# EAGLE design tappytap (EAGLE 7.3.0)
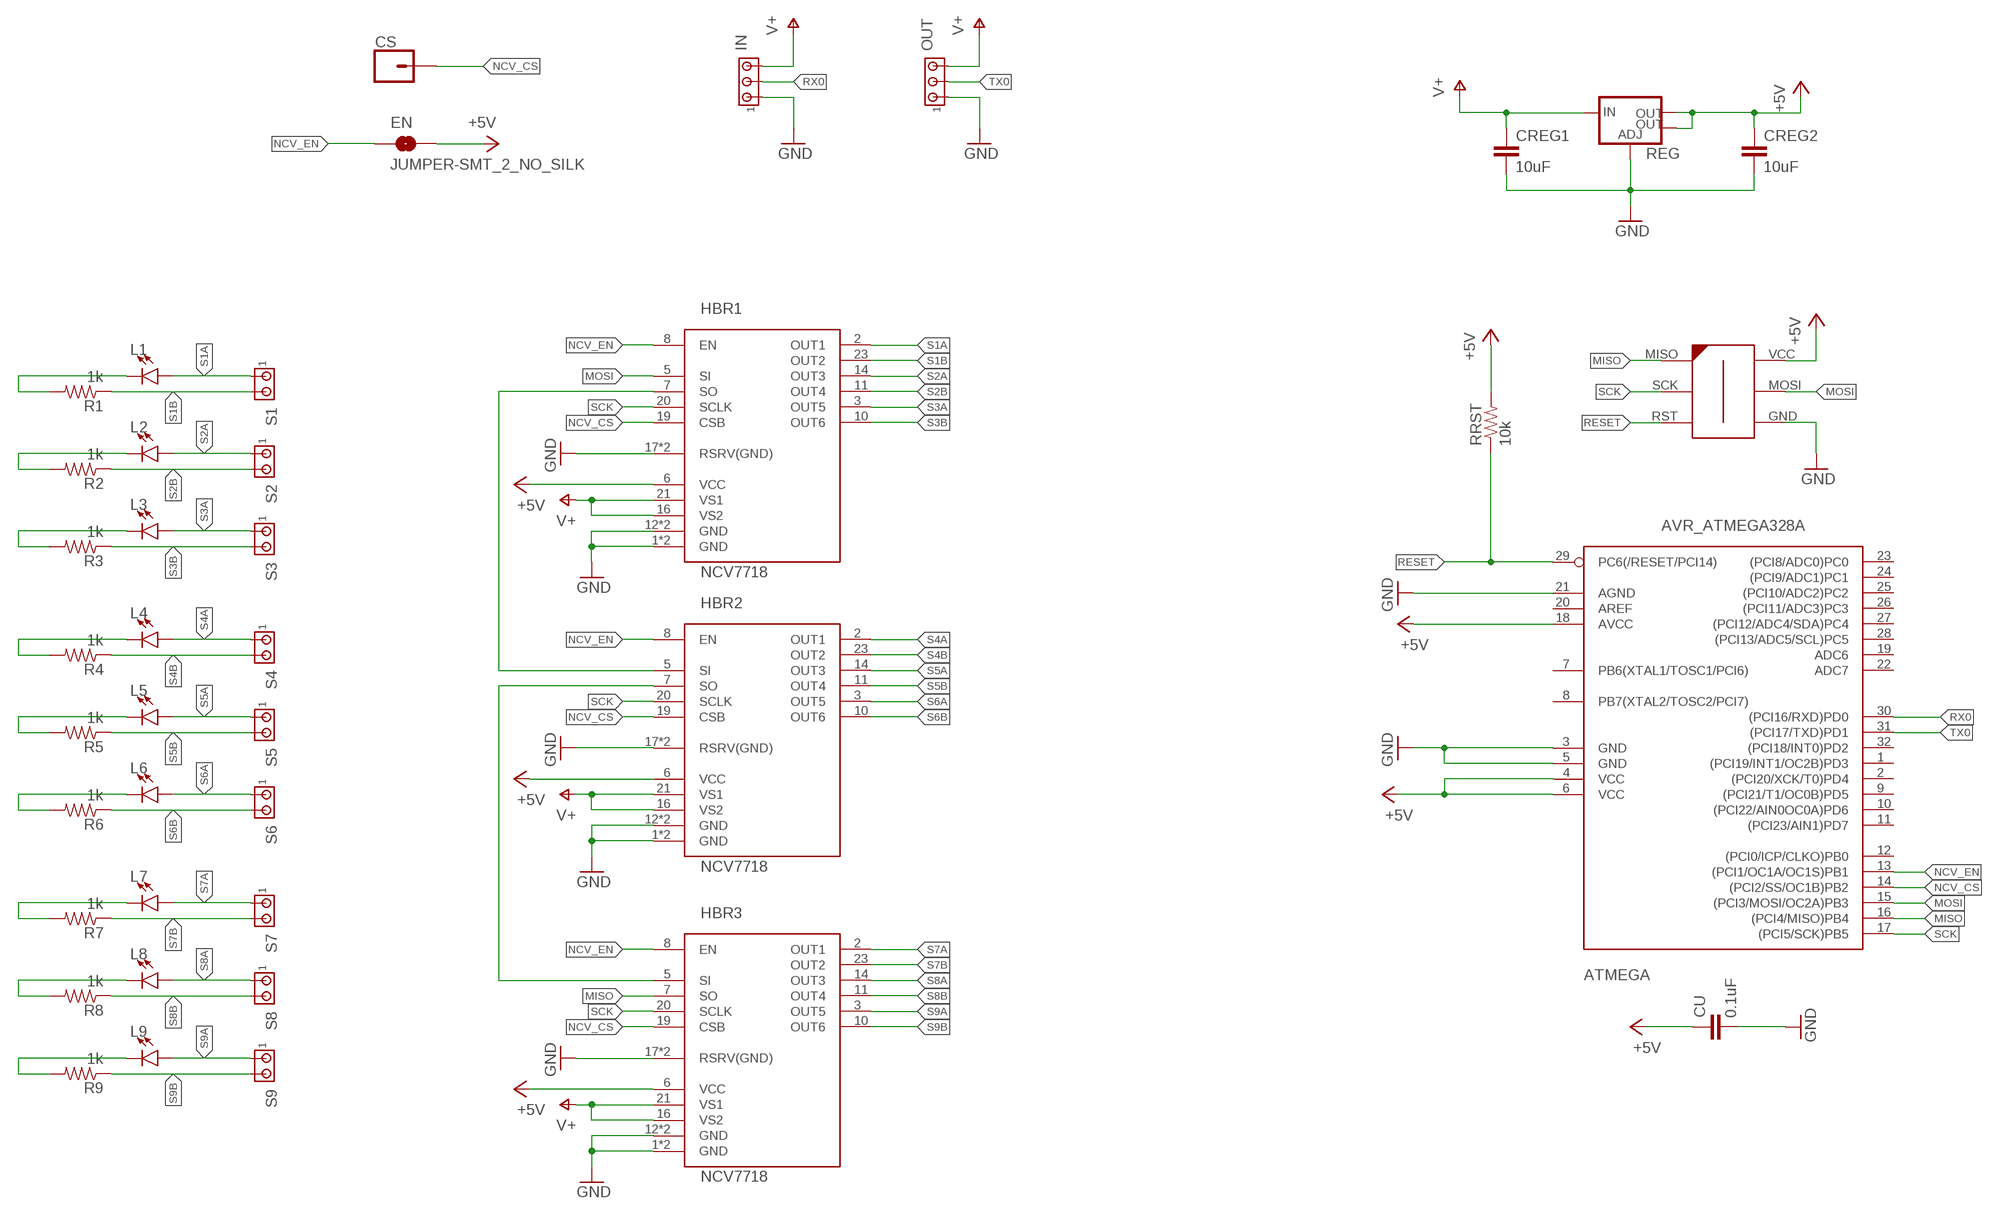
[diagram p0: schematic, sheet 1]

## Parts
ATMEGA  AVR_ATMEGA328A  [AVR_TQFP32-08]
CREG1  10uF  C-EUC0603  [C0603]
CREG2  10uF  C-EUC0603  [C0603]
CS  CONN_01  [1X01]
CU  0.1uF  C-EUC0603  [C0603]
EN  JUMPER-SMT_2_NO_SILK  [SMT-JUMPER_2_NO_SILK]
HBR1  NCV7718  [24-SSOP]
HBR2  NCV7718  [24-SSOP]
HBR3  NCV7718  [24-SSOP]
IN  MTA03-100  [10X03MTA]
ISP  AVR-ISP-6-EDGE  [6PAD_ISP]
L1  LED0603  [LED-0603]
L2  LED0603  [LED-0603]
L3  LED0603  [LED-0603]
L4  LED0603  [LED-0603]
L5  LED0603  [LED-0603]
L6  LED0603  [LED-0603]
L7  LED0603  [LED-0603]
L8  LED0603  [LED-0603]
L9  LED0603  [LED-0603]
OUT  MTA03-100  [10X03MTA]
R1  1k  R-US_R0603  [R0603]
R2  1k  R-US_R0603  [R0603]
R3  1k  R-US_R0603  [R0603]
R4  1k  R-US_R0603  [R0603]
R5  1k  R-US_R0603  [R0603]
R6  1k  R-US_R0603  [R0603]
R7  1k  R-US_R0603  [R0603]
R8  1k  R-US_R0603  [R0603]
R9  1k  R-US_R0603  [R0603]
REG  V_REG_LM1117SOT223  [SOT223]
RRST  10k  R-US_R0603  [R0603]
S1  MTA02-100  [10X02MTA]
S2  MTA02-100  [10X02MTA]
S3  MTA02-100  [10X02MTA]
S4  MTA02-100  [10X02MTA]
S5  MTA02-100  [10X02MTA]
S6  MTA02-100  [10X02MTA]
S7  MTA02-100  [10X02MTA]
S8  MTA02-100  [10X02MTA]
S9  MTA02-100  [10X02MTA]

## Nets
+5V [usbvcc]: ATMEGA.4(VCC) ATMEGA.6(VCC) ATMEGA.18(AVCC) CREG2.1 CU.1 EN.2 HBR1.6(VCC) HBR2.6(VCC) HBR3.6(VCC) ISP.VCC REG.2(OUT) REG.4(OUT) RRST.2
GND [gnd]: ATMEGA.3(GND) ATMEGA.5(GND) ATMEGA.21(AGND) CREG1.2 CREG2.2 CU.2 HBR1.1(GND) HBR1.12(GND) HBR1.13(GND) HBR1.17(RSRV(GND)) HBR1.18(RSRV(GND)) HBR1.24(GND) HBR2.1(GND) HBR2.12(GND) HBR2.13(GND) HBR2.17(RSRV(GND)) HBR2.18(RSRV(GND)) HBR2.24(GND) HBR3.1(GND) HBR3.12(GND) HBR3.13(GND) HBR3.17(RSRV(GND)) HBR3.18(RSRV(GND)) HBR3.24(GND) IN.1 ISP.GND OUT.1 REG.1(ADJ)
MISO: ATMEGA.16((PCI4/MISO)PB4) HBR3.7(SO) ISP.MISO
MOSI: ATMEGA.15((PCI3/MOSI/OC2A)PB3) HBR1.5(SI) ISP.MOSI
N$5: L1.C R1.2
N$9: L2.C R2.2
N$12: L3.C R3.2
N$15: L4.C R4.2
N$18: L5.C R5.2
N$21: L6.C R6.2
N$24: HBR1.7(SO) HBR2.5(SI)
N$25: L7.C R7.2
N$26: HBR2.7(SO) HBR3.5(SI)
N$29: L8.C R8.2
N$32: L9.C R9.2
NCV_CS: ATMEGA.14((PCI2/SS/OC1B)PB2) CS.1 HBR1.19(CSB) HBR2.19(CSB) HBR3.19(CSB)
NCV_EN: ATMEGA.13((PCI1/OC1A/OC1S)PB1) EN.1 HBR1.8(EN) HBR2.8(EN) HBR3.8(EN)
RESET: ATMEGA.29(PC6(/RESET/PCI14)) ISP.RST RRST.1
RX0: ATMEGA.30((PCI16/RXD)PD0) IN.2
S1A: HBR1.2(OUT1) L1.A S1.1
S1B: HBR1.23(OUT2) R1.1 S1.2
S2A: HBR1.14(OUT3) L2.A S2.1
S2B: HBR1.11(OUT4) R2.1 S2.2
S3A: HBR1.3(OUT5) L3.A S3.1
S3B: HBR1.10(OUT6) R3.1 S3.2
S4A: HBR2.2(OUT1) L4.A S4.1
S4B: HBR2.23(OUT2) R4.1 S4.2
S5A: HBR2.14(OUT3) L5.A S5.1
S5B: HBR2.11(OUT4) R5.1 S5.2
S6A: HBR2.3(OUT5) L6.A S6.1
S6B: HBR2.10(OUT6) R6.1 S6.2
S7A: HBR3.2(OUT1) L7.A S7.1
S7B: HBR3.23(OUT2) R7.1 S7.2
S8A: HBR3.14(OUT3) L8.A S8.1
S8B: HBR3.11(OUT4) R8.1 S8.2
S9A: HBR3.3(OUT5) L9.A S9.1
S9B: HBR3.10(OUT6) R9.1 S9.2
SCK: ATMEGA.17((PCI5/SCK)PB5) HBR1.20(SCLK) HBR2.20(SCLK) HBR3.20(SCLK) ISP.SCK
TX0: ATMEGA.31((PCI17/TXD)PD1) OUT.2
V+: CREG1.1 HBR1.16(VS2) HBR1.21(VS1) HBR2.16(VS2) HBR2.21(VS1) HBR3.16(VS2) HBR3.21(VS1) IN.3 OUT.3 REG.3(IN)
Unconnected: ATMEGA.1((PCI19/INT1/OC2B)PD3) ATMEGA.2((PCI20/XCK/T0)PD4) ATMEGA.7(PB6(XTAL1/TOSC1/PCI6)) ATMEGA.8(PB7(XTAL2/TOSC2/PCI7)) ATMEGA.9((PCI21/T1/OC0B)PD5) ATMEGA.10((PCI22/AIN0OC0A)PD6) ATMEGA.11((PCI23/AIN1)PD7) ATMEGA.12((PCI0/ICP/CLKO)PB0) ATMEGA.19(ADC6) ATMEGA.20(AREF) ATMEGA.22(ADC7) ATMEGA.23((PCI8/ADC0)PC0) ATMEGA.24((PCI9/ADC1)PC1) ATMEGA.25((PCI10/ADC2)PC2) ATMEGA.26((PCI11/ADC3)PC3) ATMEGA.27((PCI12/ADC4/SDA)PC4) ATMEGA.28((PCI13/ADC5/SCL)PC5) ATMEGA.32((PCI18/INT0)PD2)

## Library data of the parts
ATMEGA = avr:AVR_ATMEGA328: MICROCONTROLLER 32 kBytes FLASH 1 kBytes SRAM 512 Bytes EEPROM USART 8-channel 10 bit ADC
CREG1 CREG2 CU = rcl:C-EU: CAPACITOR, European symbol
CS = SparkFun-Connectors:CONN_01: Single connection point. Often used as Generic Header-pin footprint for 0.1 inch spaced/style header connections On any of the 0.1 inch spaced packages, you can populate with these: Break Away Headers - Straight <https://www.sparkfun.com/products/116> (PRT-00116) Break Away Male Headers - Right Angle <https://www.sparkfun.com/products/553> (PRT-00553) Female Headers <https://www.sparkfun.com/products/115> (PRT-00115) Break Away Headers - Machine Pin <https://www.sparkfun.com/products/117> (PRT-00117) Break Away Female Headers - Swiss Machine Pin <https://www.sparkfun.com/products/743> (PRT-00743) This device is also useful as a general connection point to wire up your design to another part of your project. Our various solder wires solder well into these plated through hole pads. Hook-Up Wire - Assortment (Stranded, 22 AWG) <https://www.sparkfun.com/products/11375> (PRT-11375) Hook-Up Wire - Assortment (Solid Core, 22 AWG) <https://www.sparkfun.com/products/11367> (PRT-11367) View the entire wire category on our website here <https://www.sparkfun.com/categories/141> Special notes: SMTSO-256-ET is a "flush mount" nut for a 4-40 screw. We mostly use this on specialty testbeds; it is a nice way to connect hardware to your PCB at an adjustable hieght. Also note, the SNAP packages are for using a snappable style connector. We sell a baggie of snaps and they are also used on two LilyPad designs: Snap Assortment - 30 pack (male and female) <https://www.sparkfun.com/products/11347> (DEV-11347) LilyPad Arduino SimpleSnap <https://www.sparkfun.com/products/10941> (DEV-10941) LilyPad SimpleSnap Protoboard <https://www.sparkfun.com/products/10940> (DEV-10940)
EN = SparkFun-Jumpers:JUMPER-SMT_2_NO: Normally open jumper This jumper has two pads in close proximity to each other. Apply solder to close the connection. Round pads are easier to solder for beginners, but are a lot larger. SparkFun Product that uses the round pads: SparkFun EL Sequencer <https://www.sparkfun.com/products/12781>
HBR1-HBR3 = Sparky:NCV7718: Hex Half−Bridge Driver. The device can be operated in forward, reverse, brake, and high impedance states. The drivers are controlled via a 16 bit SPI interface and are daisy chain compatible.
IN OUT = con-amp:MTA03-100: AMP connector
ISP = avr-6:AVR-ISP-6-EDGE: 6 pin edge connector for ISP with ATMEL MCUs. Developed by Craig Moates (craig at moates dot net). Library by David Blundell (blundar at gmail dot com). Often, even a 6 pin header is really inconvenient for board layout and/or production. This SMD-only header is our de-facto standard for using an edge connector for programming with the help of a 6pin/10pin to edge card adapter.
L1-L9 = SparkFun-LED:LED: LED (Generic) Standard schematic elements and footprints for 5mm, 3mm, 1206, and 0603 sized LEDs. Generic LEDs with no color specified.
R1-R9 RRST = rcl:R-US_: RESISTOR, American symbol
REG = SparkFun-IC-Power:V_REG_LM1117: Voltage Regulator LM1117 Standard adjustable voltage regulator but in SMD form. Spark Fun Electronics SKU : COM-00595; PROD_ID: VREG-08170
S1-S9 = con-amp:MTA02-100: AMP connector

## Board
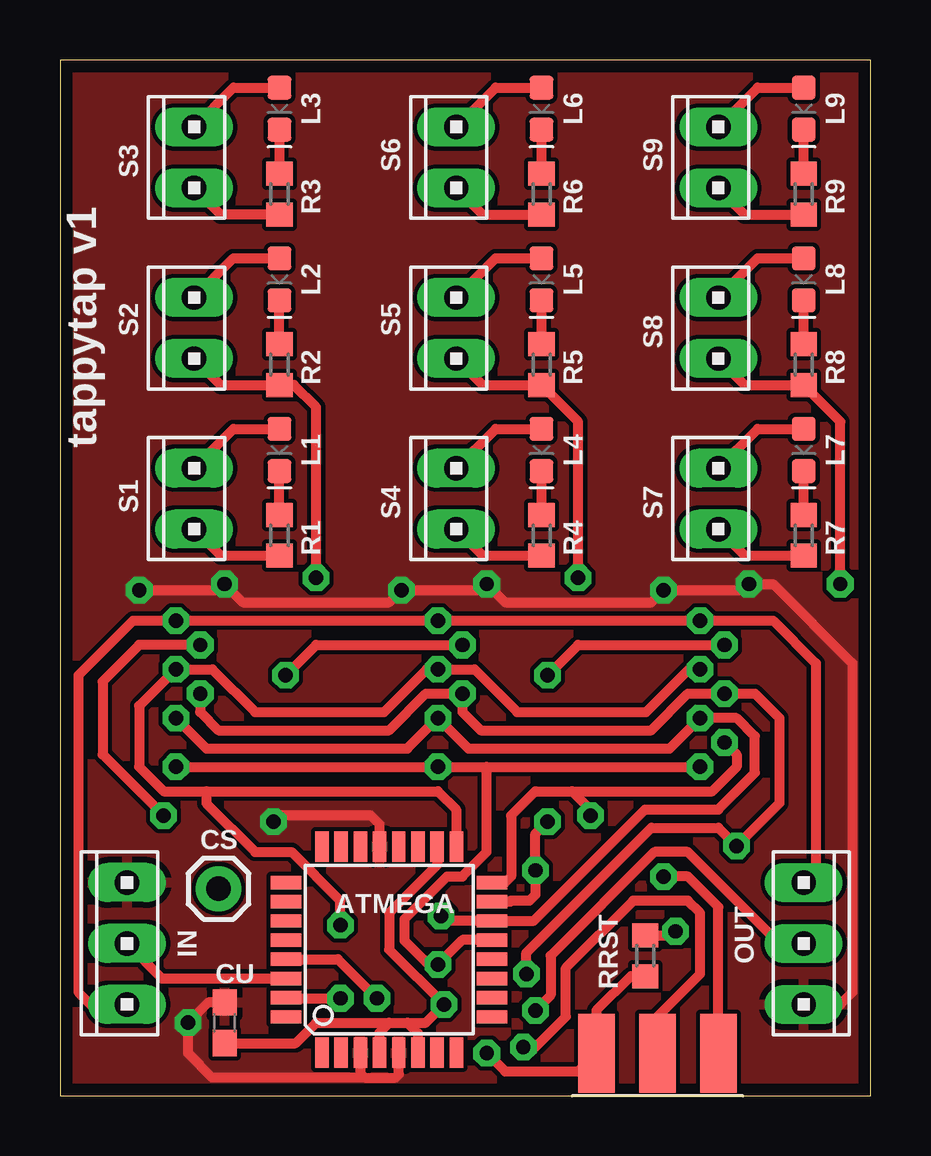
[diagram p1: board, top side]
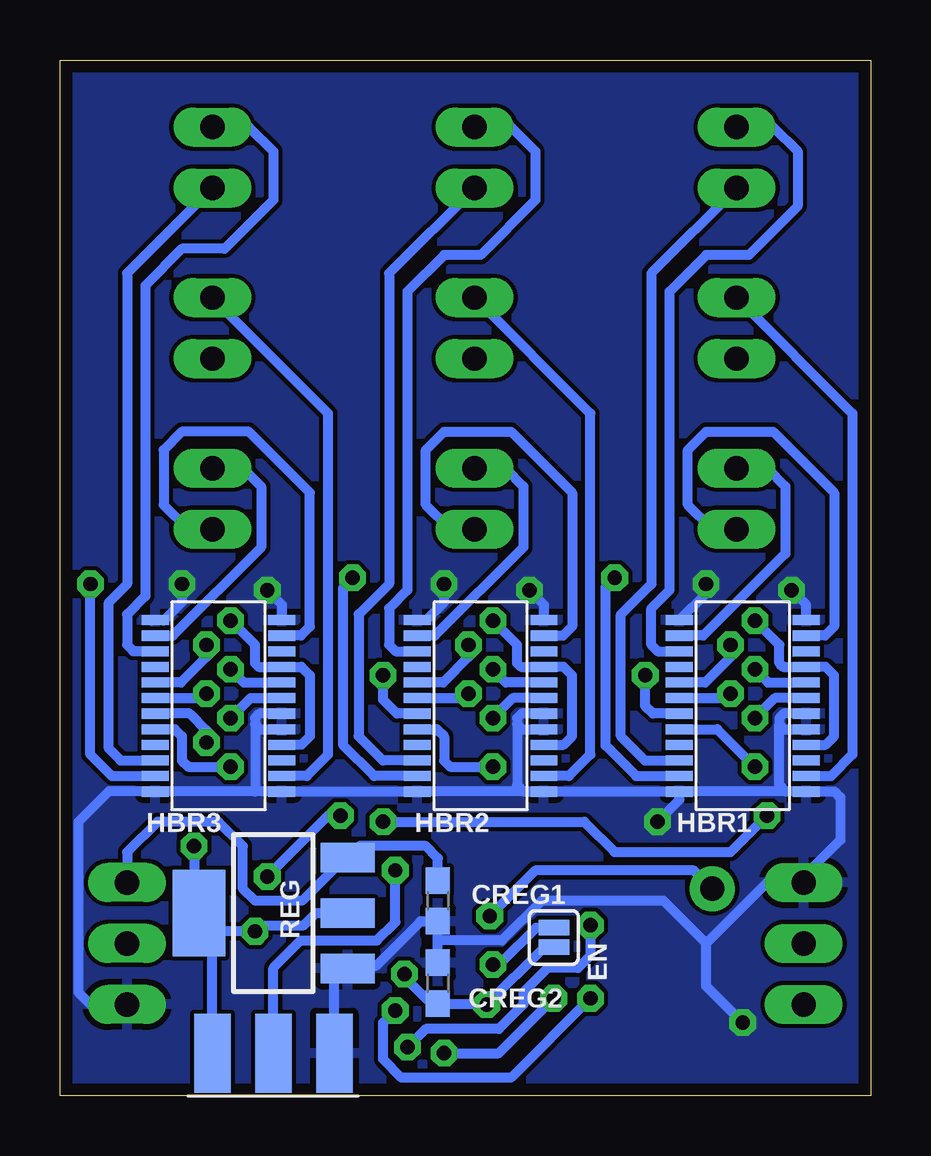
[diagram p2: board, bottom side, seen from below]

Size 33.78 x 43.18 mm. Coordinates in mm from the lower left corner, seen from the top.
Outline: 0,0 33.78,0 33.78,43.18 0,43.18 0,0
Copper layers (1*16): Top 0.035mm / dielectric 1.5mm / Bottom 0.035mm
Design rules "APC *": minimum track width 7mil, minimum drill 15mil, track to track 7mil, track to pad 7mil, pad to pad 7mil, via to via 7mil, smd to smd 0mil, copper to edge 20mil, drill to drill 20mil, minimum pad ring 12mil, minimum via ring 10mil, stop-mask expansion 4mil, vias tented up to drill 25mil, thermal gap 10mil

### Footprints (pad centres in the part's own frame; a part is rotated, then mirrored left to right if it is on the bottom)
AVR_TQFP32-08 = smd 1.27 x 0.559: 1 -4.293,2.8; 2 -4.293,2; 3 -4.293,1.2; 4 -4.293,0.4; 5 -4.293,-0.4; 6 -4.293,-1.2; 7 -4.293,-2; 8 -4.293,-2.8; 17 4.293,-2.8; 18 4.293,-2; 19 4.293,-1.2; 20 4.293,-0.4; 21 4.293,0.4; 22 4.293,1.2; 23 4.293,2; 24 4.293,2.8 | smd 0.559 x 1.27: 9 -2.8,-4.293; 10 -2,-4.293; 11 -1.2,-4.293; 12 -0.4,-4.293; 13 0.4,-4.293; 14 1.2,-4.293; 15 2,-4.293; 16 2.8,-4.293; 25 2.8,4.293; 26 2,4.293; 27 1.2,4.293; 28 0.4,4.293; 29 -0.4,4.293; 30 -1.2,4.293; 31 -2,4.293; 32 -2.8,4.293
C0603 = smd 1.1 x 1: 1 -0.85,0; 2 0.85,0
1X01 = drill 1.016 pad 1.88: 1 0,0
SMT-JUMPER_2_NO_SILK = smd 0.635 x 1.27: 1 -0.406,0; 2 0.406,0
24-SSOP = smd 1.12 x 0.42: 1 -2.64,3.575; 2 -2.64,2.925; 3 -2.64,2.275; 4 -2.64,1.625; 5 -2.64,0.975; 6 -2.64,0.325; 7 -2.64,-0.325; 8 -2.64,-0.975; 9 -2.64,-1.625; 10 -2.64,-2.275; 11 -2.64,-2.925; 12 -2.64,-3.575; 13 2.64,-3.575; 14 2.64,-2.925; 15 2.64,-2.275; 16 2.64,-1.625; 17 2.64,-0.975; 18 2.64,-0.325; 19 2.64,0.325; 20 2.64,0.975; 21 2.64,1.625; 22 2.64,2.275; 23 2.64,2.925; 24 2.64,3.575
10X03MTA = drill 1.016 long: 1 2.54,0; 2 0,0; 3 -2.54,0
6PAD_ISP = smd 1.524 x 3.302 bottom: GND 2.54,0; MOSI 0,0; VCC -2.54,0 | smd 1.524 x 3.302: MISO -2.54,0; RST 2.54,0; SCK 0,0
LED-0603 = smd 1 x 1: A -0.877,0; C 0.877,0
R0603 = smd 1 x 1.1: 1 -0.85,0; 2 0.85,0
SOT223 = smd 1.219 x 2.235: 1 -2.311,-3.099; 2 0,-3.099; 3 2.311,-3.099 | smd 3.6 x 2.2: 4 0,3.099
10X02MTA = drill 1.016 long: 1 1.27,0; 2 -1.27,0

### Placement (x,y rotation side)
ATMEGA  13.72,6.1 90 top
CREG1  18.03,8.13 270 bottom
CREG2  18.03,4.7 90 bottom
CS  6.6,8.64 0 top
CU  6.86,3.05 90 top
EN  13.21,6.6 270 bottom
HBR1  5.33,16.26 0 bottom
HBR2  16.26,16.26 0 bottom
HBR3  27.18,16.26 0 bottom
IN  2.79,6.35 90 top
ISP  24.89,1.78 180 top
L1  9.14,26.92 270 top
L2  9.14,34.04 270 top
L3  9.14,41.15 270 top
L4  20.07,26.92 270 top
L5  20.07,34.04 270 top
L6  20.07,41.15 270 top
L7  30.99,26.92 270 top
L8  30.99,34.04 270 top
L9  30.99,41.15 270 top
OUT  30.99,6.35 270 top
R1  9.14,23.37 90 top
R2  9.14,30.48 90 top
R3  9.14,37.59 90 top
R4  20.07,23.37 90 top
R5  20.07,30.48 90 top
R6  20.07,37.59 90 top
R7  30.99,23.37 90 top
R8  30.99,30.48 90 top
R9  30.99,37.59 90 top
REG  24.89,7.62 90 bottom
RRST  24.38,5.84 90 top
S1  5.59,24.89 90 top
S2  5.59,32 90 top
S3  5.59,39.12 90 top
S4  16.51,24.89 90 top
S5  16.51,32 90 top
S6  16.51,39.12 90 top
S7  27.43,24.89 90 top
S8  27.43,32 90 top
S9  27.43,39.12 90 top

### Tracks (layer width: path | path; a pad name or v marks a point on that pad's centre or on a via)
+5V  (via drill 0.6)
  Top 0.406: v5.84,16.76 5.84,16 6.6,15.24 13.72,15.24 15.24,16.76 v16.76,16.76 16.76,16 17.53,15.24 24.64,15.24 26.16,16.76 v27.69,16.76 28.96,16.76 29.97,15.75 29.97,12.19 v28.19,10.41 27.43,11.18 24.64,11.18 19.43,5.97 v19.43,5.08 | ATMEGA.4 13.32,2.65 13.72,3.05 | 13.72,3.05 14.48,3.05 | 14.48,3.05 14.92,2.61 ATMEGA.6 | 15.75,10.42 ATMEGA.18 | 15.75,10.36 ATMEGA.18 | CU.1 9.82,2.2 10.67,3.05 13.72,3.05 | RRST.2 25.49,6.69 v25.65,6.86 | 14.48,3.05 15.24,3.05 v16,3.81 13.72,6.1 13.72,7.62 15.72,9.62 ATMEGA.18
  Bottom 0.406: ISP.VCC 27.43,7.37 | 27.43,7.37 27.43,7.62 REG.4 28.19,7.82 v28.19,10.41 | 27.43,7.37 26.92,6.86 v25.65,6.86 25.4,7.11 23.62,7.11 23.11,7.62 REG.2 | v19.43,5.08 19.43,4.95 18.33,3.85 CREG2.1 18,3.81 v16,3.81 13.61,6.2 EN.2 | HBR1.6 6.03,16.58 v5.84,16.76 | HBR2.6 16.95,16.58 v16.76,16.76 | HBR3.6 27.87,16.58 v27.69,16.76
GND  (via drill 0.6)
  Top 0.406: v3.3,21.08 6.6,21.08 v6.86,21.34 7.62,20.57 13.72,20.57 v14.22,21.08 17.53,21.08 v17.78,21.34 18.54,20.57 24.64,20.57 v25.15,21.08 28.45,21.08 v28.7,21.34 29.72,21.34 33.02,18.03 33.02,4.32 32.51,3.81 OUT.1 | ATMEGA.21 13.32,11.32 12.95,11.68 9.14,11.68 v8.89,11.43 | ATMEGA.3 12.52,0.95 12.7,0.76 | 12.7,0.76 13.97,0.76 14.12,0.91 ATMEGA.5 | CU.2 6.18,3.9 v5.33,3.05 5.33,1.78 6.35,0.76 12.7,0.76
  Bottom 0.406: v14.22,21.08 13.62,20.47 HBR2.24 | v25.15,21.08 24.54,20.47 HBR3.24 | v28.7,21.34 28.7,20.57 29.46,19.81 29.97,19.81 | OUT.1 32.51,3.81 33.02,4.32 33.02,11.43 31.75,12.7 29.97,12.7 29.95,12.68 25.65,12.68 | CREG2.2 18.03,6.48 | 18.03,6.48 CREG1.2 | v5.33,3.05 6.86,4.57 6.86,6.35 | ISP.GND 22.35,4.75 REG.1 21.68,5.42 20.61,5.42 18.76,7.28 CREG1.2 | 18.38,7.28 CREG1.2 | HBR1.18 3.63,15.93 3.81,15.75 3.81,15.49 | 3.81,15.49 3.6,15.28 HBR1.17 | 3.56,12.7 3.54,12.68 HBR1.13 1.5,12.68 1.27,12.45 1.27,10.67 2.79,9.14 IN.1 4.32,8.89 6.86,6.35 | 3.56,12.7 3.81,12.95 3.81,15.49 | HBR1.1 6.86,20.95 v6.86,21.34 | HBR1.24 2.69,20.47 v3.3,21.08 | HBR2.1 18.52,19.83 17.78,20.57 v17.78,21.34 | HBR2.18 14.55,15.93 14.73,15.75 14.73,15.49 | 14.73,15.49 14.52,15.28 HBR2.17 | 14.73,15.49 14.73,12.95 14.46,12.68 | 14.46,12.68 HBR2.13 HBR1.12 7.97,12.35 v8.89,11.43 | HBR2.12 HBR3.13 25.65,12.68 | 3.56,12.7 8.13,12.7 | 14.46,12.68 19.29,12.68 19.3,12.7 | HBR3.18 25.47,15.93 25.65,15.75 25.65,15.49 | 25.65,15.49 25.44,15.28 HBR3.17 | 25.65,15.49 25.65,12.68 | 6.86,6.35 8.64,8.13 13.72,8.13 15.37,6.48 18.03,6.48
  pour Bottom: 0,0 0,43.18 33.78,43.18 33.78,0
  pour Top: 0,0 0,43.18 33.78,43.18 33.78,0
MISO  (via drill 0.6)
  Top 0.406: v27.69,14.73 28.19,14.22 28.19,13.72 27.18,12.7 21.34,12.7 | ATMEGA.16 18.54,8.89 18.8,9.14 18.8,11.68 19.81,12.7 21.34,12.7 | ISP.MISO 27.43,7.87 26.16,9.14 v25.15,9.14 | v22.1,11.68 22.1,11.94 21.34,12.7
  Bottom 0.406: v27.69,14.73 27.69,15.24 28.38,15.93 HBR3.7 | v25.15,9.14 22.61,11.68 v22.1,11.68
MOSI  (via drill 0.6)
  Top 0.406: v5.84,18.8 3.3,18.8 1.78,17.27 1.78,14.22 v4.32,11.68 | ATMEGA.15 18.76,8.1 18.8,8.13 19.56,8.13 19.81,8.38 v19.81,9.4 19.81,10.92 v20.32,11.43
  Bottom 0.406: v5.84,18.8 5.84,18.29 6.86,17.27 6.9,17.23 HBR1.5 | v4.32,11.68 5.84,10.16 10.67,10.16 11.94,11.43 v20.32,11.43 | ISP.MOSI 24.89,5.33 23.75,6.48 20.57,6.48 19.81,7.24 v19.81,9.4
N$5
  Top 0.406: R1.2 L1.C
N$9
  Top 0.406: R2.2 L2.C
N$12
  Top 0.406: L3.C R3.2
N$15
  Top 0.406: R4.2 L4.C
N$18
  Top 0.406: R5.2 L5.C
N$21
  Top 0.406: R6.2 L6.C
N$24  (via drill 0.6)
  Top 0.406: v9.4,17.53 10.67,18.8 v16.76,18.8
  Bottom 0.406: HBR1.7 9.07,15.93 9.4,16.26 v9.4,17.53 | v16.76,18.8 16.76,18.29 17.82,17.23 HBR2.5
N$25
  Top 0.406: R7.2 L7.C
N$26  (via drill 0.6)
  Top 0.406: v20.32,17.53 21.59,18.8 v27.69,18.8
  Bottom 0.406: HBR2.7 19.74,15.93 20.32,16.51 v20.32,17.53 | v27.69,18.8 27.69,18.29 28.74,17.23 HBR3.5
N$29
  Top 0.406: R8.2 L8.C
N$32
  Top 0.406: R9.2 L9.C
NCV_CS  (via drill 0.6)
  Top 0.406: v4.83,15.75 6.1,14.48 14.48,14.48 v15.75,15.75 17.02,14.48 25.4,14.48 v26.67,15.75 28.19,15.75 28.96,14.99 28.96,13.46 27.43,11.94 24.38,11.94 19.74,7.3 ATMEGA.14 16.07,7.3 v15.88,7.49
  Bottom 0.406: v4.83,15.75 3.99,16.58 HBR1.19 | v15.75,15.75 14.91,16.58 HBR2.19 | v26.67,15.75 25.84,16.58 HBR3.19 | CS.1 7.37,9.4 13.97,9.4 v15.88,7.49
NCV_EN  (via drill 0.6)
  Top 0.406: v4.83,13.72 v15.75,13.72 17.78,13.72 | 17.78,13.72 v26.67,13.72 | 17.78,13.72 17.78,10.16 16.76,9.14 16.13,9.14 14.35,7.37 14.35,6.48 15.35,5.48 v15.75,5.48 16.76,6.5 ATMEGA.13
  Bottom 0.406: v15.75,13.72 17.53,13.72 17.78,13.97 17.78,14.99 18.07,15.28 HBR2.8 | v26.67,13.72 28.45,13.72 28.7,13.97 28.7,14.99 29,15.28 HBR3.8 | v4.83,13.72 6.39,15.28 HBR1.8 | EN.1 13.95,7.01 15.47,5.48 v15.75,5.48
RESET  (via drill 0.6)
  Top 0.406: 22.35,2.54 ISP.RST | RRST.1 23.79,4.99 22.35,3.56 ISP.RST | v17.78,1.78 18.54,1.02 21.59,1.02 ISP.RST | ATMEGA.29 11.58,5.7 v13.21,4.06
  Bottom 0.406: v17.78,1.78 15.49,1.78 v13.21,4.06
RX0
  Top 0.406: IN.2 4.25,4.9 ATMEGA.30
S1A
  Top 0.406: S1.1 7.23,27.8 L1.A
  Bottom 0.406: S1.1 4.32,26.16 3.56,25.4 3.56,22.61 6.98,19.18 HBR1.2
S1B
  Top 0.406: S1.2 6.69,22.52 R1.1
  Bottom 0.406: S1.2 6.6,23.62 7.62,24.64 7.62,26.92 6.86,27.69 4.06,27.69 1.52,25.15 1.52,19.56 1.9,19.18 HBR1.23
S2A
  Top 0.406: S2.1 7.23,34.91 L2.A
  Bottom 0.406: S2.1 0.76,28.45 0.76,14.22 1.66,13.33 HBR1.14
S2B  (via drill 0.6)
  Top 0.406: S2.2 6.69,29.63 R2.1 9.74,29.63 10.67,28.7 v10.67,21.59
  Bottom 0.406: v10.67,21.59 11.05,21.21 11.05,14.61 9.78,13.33 HBR1.11
S3A
  Top 0.406: S3.1 7.23,42.02 L3.A
  Bottom 0.406: S3.1 4.06,40.39 3.05,39.37 3.05,37.08 5.08,35.05 6.86,35.05 8.38,33.53 8.38,21.08 9.14,20.32 9.14,18.8 8.88,18.53 HBR1.3
S3B
  Top 0.406: R3.1 6.69,36.74 S3.2
  Bottom 0.406: S3.2 9.14,34.29 9.14,21.34 10.41,20.07 10.41,14.99 9.41,13.98 HBR1.10
S4A
  Top 0.406: S4.1 18.15,27.8 L4.A
  Bottom 0.406: S4.1 15.24,26.16 14.48,25.4 14.48,22.86 18.16,19.18 HBR2.2
S4B
  Top 0.406: S4.2 17.61,22.52 R4.1
  Bottom 0.406: S4.2 17.53,23.62 18.54,24.64 18.54,26.92 17.78,27.69 14.99,27.69 12.45,25.15 12.45,19.56 12.82,19.18 HBR2.23
S5A
  Top 0.406: S5.1 18.15,34.91 L5.A
  Bottom 0.406: S5.1 11.68,28.45 11.68,14.22 12.58,13.33 HBR2.14
S5B  (via drill 0.6)
  Top 0.406: S5.2 17.61,29.63 R5.1 21.59,28.11 v21.59,21.59
  Bottom 0.406: v21.59,21.59 21.97,21.21 21.97,14.61 20.7,13.33 HBR2.11
S6A
  Top 0.406: S6.1 18.15,42.02 L6.A
  Bottom 0.406: S6.1 14.99,40.39 13.97,39.37 13.97,37.34 16.26,35.05 17.78,35.05 19.3,33.53 19.3,21.08 20.07,20.32 20.07,18.8 19.8,18.53 HBR2.3
S6B
  Top 0.406: S6.2 17.61,36.74 R6.1
  Bottom 0.406: S6.2 20.07,34.29 20.07,21.34 21.34,20.07 21.34,14.99 20.33,13.98 HBR2.10
S7A
  Top 0.406: S7.1 29.07,27.8 L7.A
  Bottom 0.406: S7.1 26.16,26.16 25.4,25.4 25.4,22.86 29.08,19.18 HBR3.2
S7B
  Top 0.406: S7.2 28.54,22.52 R7.1
  Bottom 0.406: S7.2 28.45,23.62 29.46,24.64 29.46,26.92 28.7,27.69 25.91,27.69 23.37,25.15 23.37,19.56 23.75,19.18 HBR3.23
S8A
  Top 0.406: S8.1 29.07,34.91 L8.A
  Bottom 0.406: S8.1 22.61,28.45 22.61,14.22 23.5,13.33 HBR3.14
S8B  (via drill 0.6)
  Top 0.406: v32.51,21.34 32.51,28.11 R8.1 28.54,29.63 S8.2
  Bottom 0.406: v32.51,21.34 32.51,14.22 31.62,13.33 HBR3.11
S9A
  Top 0.406: S9.1 29.07,42.02 L9.A
  Bottom 0.406: S9.1 25.91,40.39 24.89,39.37 24.89,37.34 26.92,35.31 28.7,35.31 30.23,33.78 30.23,20.83 30.99,20.07 30.99,18.8 30.73,18.54 29.83,18.54 HBR3.3
S9B
  Top 0.406: S9.2 28.54,36.74 R9.1
  Bottom 0.406: S9.2 30.99,34.29 30.99,21.34 31.75,20.57 31.75,14.48 31.25,13.98 HBR3.10
SCK  (via drill 0.6)
  Top 0.406: v26.67,17.78 26.2,17.78 24.43,16 19.05,16 17.27,17.78 v15.75,17.78 15.28,17.78 13.5,16 8.13,16 6.35,17.78 v4.83,17.78 3.3,16.26 3.3,13.72 4.32,12.7 6.1,12.7 | 6.1,12.7 15.75,12.7 16.51,11.94 ATMEGA.17 | ISP.SCK 24.89,3.3 26.67,5.08 26.67,7.62 26.16,8.13 23.88,8.13 21.08,5.33 21.08,3.3 19.81,2.03 v19.3,2.03 | 6.1,12.7 6.1,12.19 8.13,10.16 9.65,10.16 11.68,8.13 v11.68,7.11
  Bottom 0.406: v4.83,17.78 4.28,17.23 HBR1.20 | v26.67,17.78 26.12,17.23 HBR3.20 | v19.3,2.03 18.54,2.79 15.49,2.79 14.48,3.81 14.48,4.32 13.46,5.33 12.19,5.33 11.68,5.84 v11.68,7.11 | HBR2.20 15.2,17.23 v15.75,17.78
TX0  (via drill 0.6)
  Top 0.406: v19.81,3.56 20.45,4.19 20.45,5.84 24.77,10.16 26.16,10.16 29.97,6.35 OUT.2 | ATMEGA.31 9.46,4.06 v11.68,4.06
  Bottom 0.406: v19.81,3.56 20.32,3.05 20.32,1.52 19.56,0.76 14.99,0.76 v11.68,4.06
V+  (via drill 0.6)
  Top 0.406: IN.3 1.27,3.81 0.76,4.32 0.76,17.53 3.05,19.81 v4.83,19.81 v15.75,19.81 v26.67,19.81 29.72,19.81 31.5,18.03 31.5,9.4 OUT.3
  Bottom 0.406: v4.83,19.81 3.81,18.8 3.81,18.03 3.66,17.88 HBR1.21 1.88,17.88 1.52,17.53 1.52,14.99 1.88,14.63 HBR1.16 | v15.75,19.81 14.73,18.8 14.73,18.03 14.58,17.88 HBR2.21 12.8,17.88 12.45,17.53 12.45,14.99 12.8,14.63 HBR2.16 | v26.67,19.81 25.65,18.8 25.65,18.03 25.5,17.88 HBR3.21 23.72,17.88 23.37,17.53 23.37,14.99 23.72,14.63 HBR3.16 | CREG1.1 18.03,9.91 18.54,10.41 21.31,10.41 REG.3 21.84,9.98 23.7,8.13 25.65,8.13 26.16,8.64 26.16,10.41 27.18,11.43 29.72,11.43 30.99,10.16 OUT.3

### Text on the board
tNames: tappytap v1